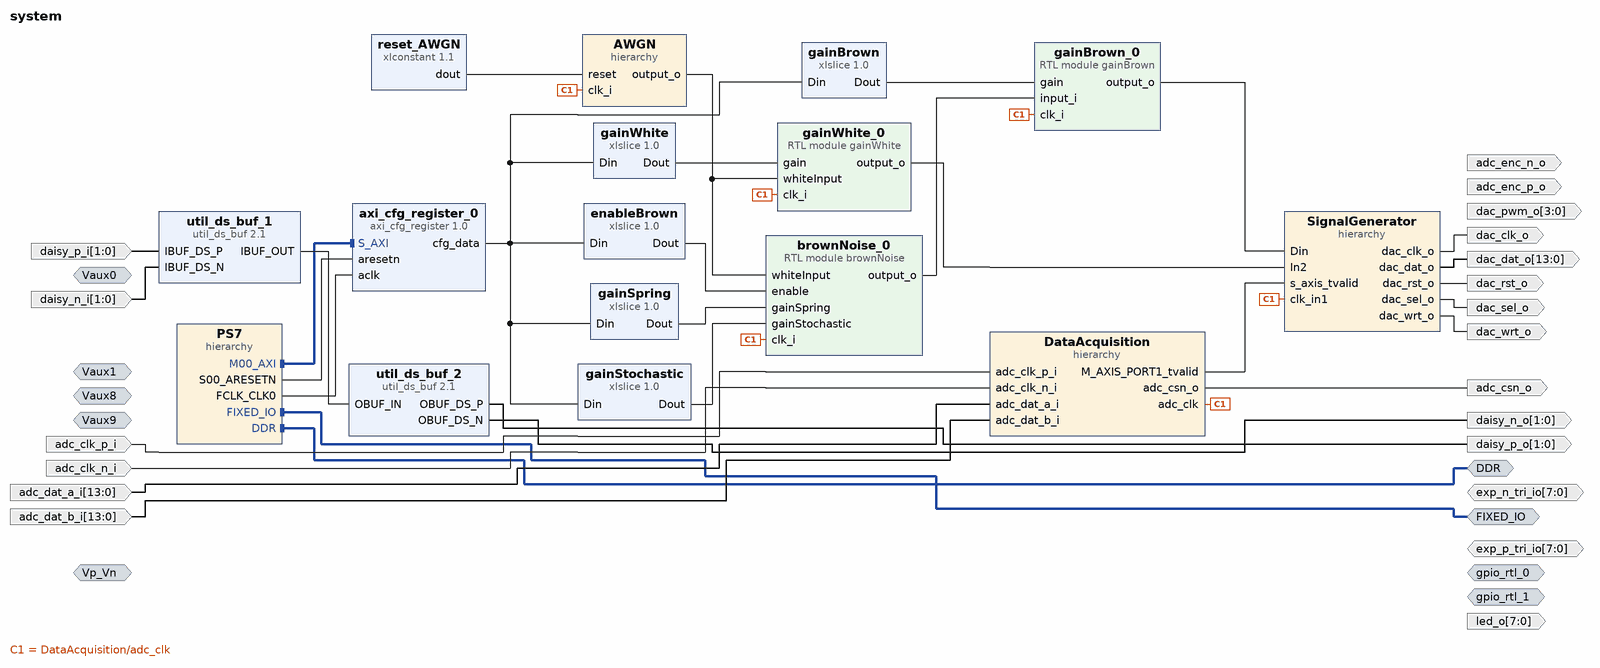
[diagram p0: block diagram of the top level]
# Vivado block design system, xc7z010clg400-1, Vivado 2020.1
create_bd_design system

create_bd_intf_port -mode Slave -vlnv xilinx.com:interface:diff_analog_io_rtl:1.0 Vp_Vn
create_bd_intf_port -mode Slave -vlnv xilinx.com:interface:diff_analog_io_rtl:1.0 Vaux0
create_bd_intf_port -mode Slave -vlnv xilinx.com:interface:diff_analog_io_rtl:1.0 Vaux1
create_bd_intf_port -mode Slave -vlnv xilinx.com:interface:diff_analog_io_rtl:1.0 Vaux9
create_bd_intf_port -mode Slave -vlnv xilinx.com:interface:diff_analog_io_rtl:1.0 Vaux8
create_bd_intf_port -mode Master -vlnv xilinx.com:interface:ddrx_rtl:1.0 DDR
create_bd_intf_port -mode Master -vlnv xilinx.com:display_processing_system7:fixedio_rtl:1.0 FIXED_IO
create_bd_intf_port -mode Master -vlnv xilinx.com:interface:gpio_rtl:1.0 gpio_rtl_0
create_bd_intf_port -mode Master -vlnv xilinx.com:interface:gpio_rtl:1.0 gpio_rtl_1
create_bd_port -dir I -from 13 -to 0 adc_dat_a_i
create_bd_port -dir I -from 13 -to 0 adc_dat_b_i
create_bd_port -dir I adc_clk_p_i
create_bd_port -dir I adc_clk_n_i
create_bd_port -dir O adc_enc_p_o
create_bd_port -dir O adc_enc_n_o
create_bd_port -dir O adc_csn_o
create_bd_port -dir O -from 13 -to 0 dac_dat_o
create_bd_port -dir O dac_clk_o
create_bd_port -dir O dac_rst_o
create_bd_port -dir O dac_sel_o
create_bd_port -dir O dac_wrt_o
create_bd_port -dir O -from 3 -to 0 dac_pwm_o
create_bd_port -dir IO -from 7 -to 0 exp_p_tri_io
create_bd_port -dir IO -from 7 -to 0 exp_n_tri_io
create_bd_port -dir O -from 1 -to 0 daisy_p_o
create_bd_port -dir O -from 1 -to 0 daisy_n_o
create_bd_port -dir I -from 1 -to 0 daisy_p_i
create_bd_port -dir I -from 1 -to 0 daisy_n_i
create_bd_port -dir O -from 7 -to 0 led_o

create_bd_cell -type ip -vlnv xilinx.com:ip:util_ds_buf:2.1 util_ds_buf_1
set_property -dict {CONFIG.C_SIZE 2} [get_bd_cells util_ds_buf_1]
create_bd_cell -type ip -vlnv xilinx.com:ip:util_ds_buf:2.1 util_ds_buf_2
set_property -dict {CONFIG.C_BUF_TYPE OBUFDS CONFIG.C_SIZE 2} [get_bd_cells util_ds_buf_2]
create_bd_cell -type hier SignalGenerator
create_bd_cell -type hier DataAcquisition
create_bd_cell -type hier PS7
create_bd_cell -type ip -vlnv pavel-demin:user:axi_cfg_register:1.0 axi_cfg_register_0
create_bd_cell -type hier AWGN
create_bd_cell -type ip -vlnv xilinx.com:ip:xlconstant:1.1 reset_AWGN
set_property -dict {CONFIG.CONST_VAL 0} [get_bd_cells reset_AWGN]
create_bd_cell -type module -reference brownNoise brownNoise_0
set_property -dict {CONFIG.deltaClk 250} [get_bd_cells brownNoise_0]
create_bd_cell -type module -reference gainBrown gainBrown_0
create_bd_cell -type ip -vlnv xilinx.com:ip:xlslice:1.0 gainSpring
set_property -dict {CONFIG.DIN_FROM 31 CONFIG.DIN_WIDTH 1024 CONFIG.DOUT_WIDTH 32} [get_bd_cells gainSpring]
create_bd_cell -type ip -vlnv xilinx.com:ip:xlslice:1.0 gainBrown
set_property -dict {CONFIG.DIN_FROM 127 CONFIG.DIN_TO 96 CONFIG.DIN_WIDTH 1024 CONFIG.DOUT_WIDTH 32} [get_bd_cells gainBrown]
create_bd_cell -type ip -vlnv xilinx.com:ip:xlslice:1.0 enableBrown
set_property -dict {CONFIG.DIN_FROM 64 CONFIG.DIN_TO 64 CONFIG.DIN_WIDTH 1024 CONFIG.DOUT_WIDTH 1} [get_bd_cells enableBrown]
create_bd_cell -type ip -vlnv xilinx.com:ip:xlslice:1.0 gainStochastic
set_property -dict {CONFIG.DIN_FROM 63 CONFIG.DIN_TO 32 CONFIG.DIN_WIDTH 1024 CONFIG.DOUT_WIDTH 32} [get_bd_cells gainStochastic]
create_bd_cell -type ip -vlnv xilinx.com:ip:xlslice:1.0 gainWhite
set_property -dict {CONFIG.DIN_FROM 159 CONFIG.DIN_TO 128 CONFIG.DIN_WIDTH 1024 CONFIG.DOUT_WIDTH 32} [get_bd_cells gainWhite]
create_bd_cell -type module -reference gainWhite gainWhite_0

# ---- hierarchy /SignalGenerator ----
current_bd_instance /SignalGenerator
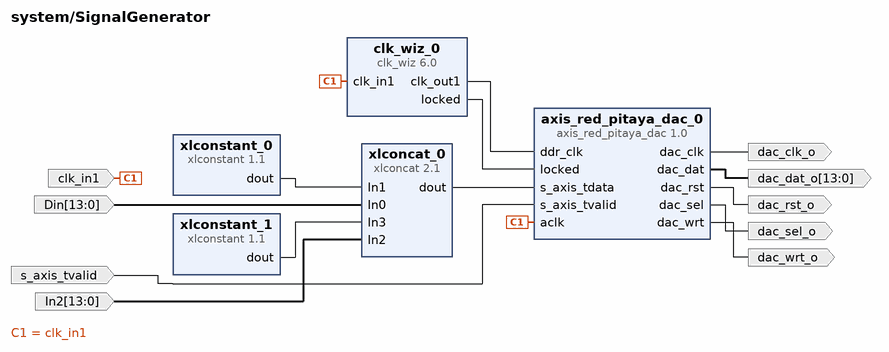
[diagram p1: block diagram inside /SignalGenerator]
create_bd_pin -dir I -type clk clk_in1
create_bd_pin -dir O -type clk dac_clk_o
create_bd_pin -dir O -type rst dac_rst_o
create_bd_pin -dir O dac_sel_o
create_bd_pin -dir O dac_wrt_o
create_bd_pin -dir O -from 13 -to 0 dac_dat_o
create_bd_pin -dir I -from 13 -to 0 Din
create_bd_pin -dir I s_axis_tvalid
create_bd_pin -dir I -from 13 -to 0 In2

create_bd_cell -type ip -vlnv pavel-demin:user:axis_red_pitaya_dac:1.0 axis_red_pitaya_dac_0
create_bd_cell -type ip -vlnv xilinx.com:ip:clk_wiz:6.0 clk_wiz_0
set_property -dict [list \
  CONFIG.CLKIN1_JITTER_PS 80.0 \
  CONFIG.CLKOUT1_JITTER 104.759 \
  CONFIG.CLKOUT1_PHASE_ERROR 96.948 \
  CONFIG.CLKOUT1_REQUESTED_OUT_FREQ 250.000 \
  CONFIG.MMCM_CLKFBOUT_MULT_F 8.000 \
  CONFIG.MMCM_CLKIN1_PERIOD 8.000 \
  CONFIG.MMCM_CLKOUT0_DIVIDE_F 4.000 \
  CONFIG.MMCM_DIVCLK_DIVIDE 1 \
  CONFIG.PRIM_IN_FREQ 125.000 \
  CONFIG.USE_RESET false \
] [get_bd_cells clk_wiz_0]
create_bd_cell -type ip -vlnv xilinx.com:ip:xlconstant:1.1 xlconstant_0
set_property -dict {CONFIG.CONST_VAL 0 CONFIG.CONST_WIDTH 2} [get_bd_cells xlconstant_0]
create_bd_cell -type ip -vlnv xilinx.com:ip:xlconcat:2.1 xlconcat_0
set_property -dict [list \
  CONFIG.IN0_WIDTH 14 \
  CONFIG.IN1_WIDTH 2 \
  CONFIG.IN2_WIDTH 14 \
  CONFIG.IN3_WIDTH 2 \
  CONFIG.NUM_PORTS 4 \
] [get_bd_cells xlconcat_0]
create_bd_cell -type ip -vlnv xilinx.com:ip:xlconstant:1.1 xlconstant_1
set_property -dict {CONFIG.CONST_VAL 0 CONFIG.CONST_WIDTH 2} [get_bd_cells xlconstant_1]

# ---- hierarchy /DataAcquisition ----
current_bd_instance /DataAcquisition
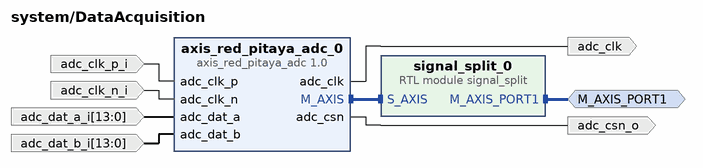
[diagram p2: block diagram inside /DataAcquisition]
create_bd_intf_pin -mode Master -vlnv xilinx.com:interface:axis_rtl:1.0 M_AXIS_PORT1
create_bd_pin -dir O -type clk adc_clk
create_bd_pin -dir O adc_csn_o
create_bd_pin -dir I adc_clk_p_i
create_bd_pin -dir I adc_clk_n_i
create_bd_pin -dir I -from 13 -to 0 adc_dat_a_i
create_bd_pin -dir I -from 13 -to 0 adc_dat_b_i

create_bd_cell -type ip -vlnv pavel-demin:user:axis_red_pitaya_adc:1.0 axis_red_pitaya_adc_0
create_bd_cell -type module -reference signal_split signal_split_0

# ---- hierarchy /PS7 ----
current_bd_instance /PS7
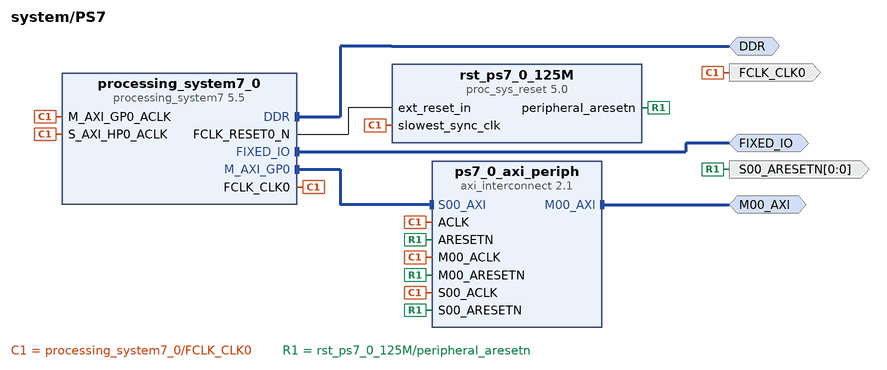
[diagram p3: block diagram inside /PS7]
create_bd_intf_pin -mode Master -vlnv xilinx.com:interface:ddrx_rtl:1.0 DDR
create_bd_intf_pin -mode Master -vlnv xilinx.com:display_processing_system7:fixedio_rtl:1.0 FIXED_IO
create_bd_intf_pin -mode Master -vlnv xilinx.com:interface:aximm_rtl:1.0 M00_AXI
create_bd_pin -dir O -type clk FCLK_CLK0
create_bd_pin -dir O -from 0 -to 0 -type rst S00_ARESETN

create_bd_cell -type ip -vlnv xilinx.com:ip:processing_system7:5.5 processing_system7_0
set_property -dict [list \
  CONFIG.PCW_APU_PERIPHERAL_FREQMHZ 666.666666 \
  CONFIG.PCW_ENET0_ENET0_IO {MIO 16 .. 27} \
  CONFIG.PCW_ENET0_GRP_MDIO_ENABLE 1 \
  CONFIG.PCW_ENET0_GRP_MDIO_IO EMIO \
  CONFIG.PCW_ENET0_PERIPHERAL_ENABLE 1 \
  CONFIG.PCW_ENET0_RESET_ENABLE 0 \
  CONFIG.PCW_ENET_RESET_ENABLE 1 \
  CONFIG.PCW_ENET_RESET_SELECT {Share reset pin} \
  CONFIG.PCW_FPGA0_PERIPHERAL_FREQMHZ 125 \
  CONFIG.PCW_FPGA1_PERIPHERAL_FREQMHZ 250 \
  CONFIG.PCW_FPGA3_PERIPHERAL_FREQMHZ 200 \
  CONFIG.PCW_GPIO_MIO_GPIO_ENABLE 1 \
  CONFIG.PCW_GPIO_MIO_GPIO_IO MIO \
  CONFIG.PCW_GPIO_PERIPHERAL_ENABLE 1 \
  CONFIG.PCW_I2C0_GRP_INT_ENABLE 0 \
  CONFIG.PCW_I2C0_I2C0_IO {MIO 50 .. 51} \
  CONFIG.PCW_I2C0_PERIPHERAL_ENABLE 1 \
  CONFIG.PCW_I2C_PERIPHERAL_FREQMHZ 111.111115 \
  CONFIG.PCW_I2C_RESET_ENABLE 1 \
  CONFIG.PCW_I2C_RESET_SELECT {Share reset pin} \
  CONFIG.PCW_IMPORT_BOARD_PRESET cfg/red_pitaya.xml \
  CONFIG.PCW_PRESET_BANK1_VOLTAGE {LVCMOS 2.5V} \
  CONFIG.PCW_QSPI_GRP_SINGLE_SS_ENABLE 1 \
  CONFIG.PCW_QSPI_GRP_SINGLE_SS_IO {MIO 1 .. 6} \
  CONFIG.PCW_QSPI_PERIPHERAL_ENABLE 1 \
  CONFIG.PCW_QSPI_PERIPHERAL_FREQMHZ 125 \
  CONFIG.PCW_QSPI_QSPI_IO {MIO 1 .. 6} \
  CONFIG.PCW_SD0_GRP_CD_ENABLE 1 \
  CONFIG.PCW_SD0_GRP_CD_IO {MIO 46} \
  CONFIG.PCW_SD0_GRP_WP_ENABLE 1 \
  CONFIG.PCW_SD0_GRP_WP_IO {MIO 47} \
  CONFIG.PCW_SD0_PERIPHERAL_ENABLE 1 \
  CONFIG.PCW_SD0_SD0_IO {MIO 40 .. 45} \
  CONFIG.PCW_SDIO_PERIPHERAL_FREQMHZ 100 \
  CONFIG.PCW_SINGLE_QSPI_DATA_MODE x4 \
  CONFIG.PCW_SPI0_PERIPHERAL_ENABLE 1 \
  CONFIG.PCW_SPI0_SPI0_IO EMIO \
  CONFIG.PCW_SPI1_PERIPHERAL_ENABLE 1 \
  CONFIG.PCW_SPI1_SPI1_IO {MIO 10 .. 15} \
  CONFIG.PCW_TTC0_PERIPHERAL_ENABLE 1 \
  CONFIG.PCW_TTC0_TTC0_IO EMIO \
  CONFIG.PCW_UART0_PERIPHERAL_ENABLE 1 \
  CONFIG.PCW_UART0_UART0_IO {MIO 14 .. 15} \
  CONFIG.PCW_UART1_PERIPHERAL_ENABLE 1 \
  CONFIG.PCW_UART1_UART1_IO {MIO 8 .. 9} \
  CONFIG.PCW_UART_PERIPHERAL_FREQMHZ 100 \
  CONFIG.PCW_UIPARAM_DDR_BUS_WIDTH {16 Bit} \
  CONFIG.PCW_UIPARAM_DDR_FREQ_MHZ 533.333333 \
  CONFIG.PCW_UIPARAM_DDR_PARTNO {MT41J256M16 RE-125} \
  CONFIG.PCW_USB0_PERIPHERAL_ENABLE 1 \
  CONFIG.PCW_USB0_RESET_ENABLE 1 \
  CONFIG.PCW_USB0_RESET_IO {MIO 48} \
  CONFIG.PCW_USB0_USB0_IO {MIO 28 .. 39} \
  CONFIG.PCW_USB_RESET_ENABLE 1 \
  CONFIG.PCW_USB_RESET_SELECT {Share reset pin} \
  CONFIG.PCW_USE_S_AXI_HP0 1 \
] [get_bd_cells processing_system7_0]
# 429 more settings of processing_system7_0 are not shown: defaults, MIO pin electricals, DDR timing, and values the tool derives
create_bd_cell -type ip -vlnv xilinx.com:ip:proc_sys_reset:5.0 rst_ps7_0_125M
create_bd_cell -type ip -vlnv xilinx.com:ip:axi_interconnect:2.1 ps7_0_axi_periph
set_property -dict {CONFIG.NUM_MI 1} [get_bd_cells ps7_0_axi_periph]

# ---- hierarchy /AWGN ----
current_bd_instance /AWGN
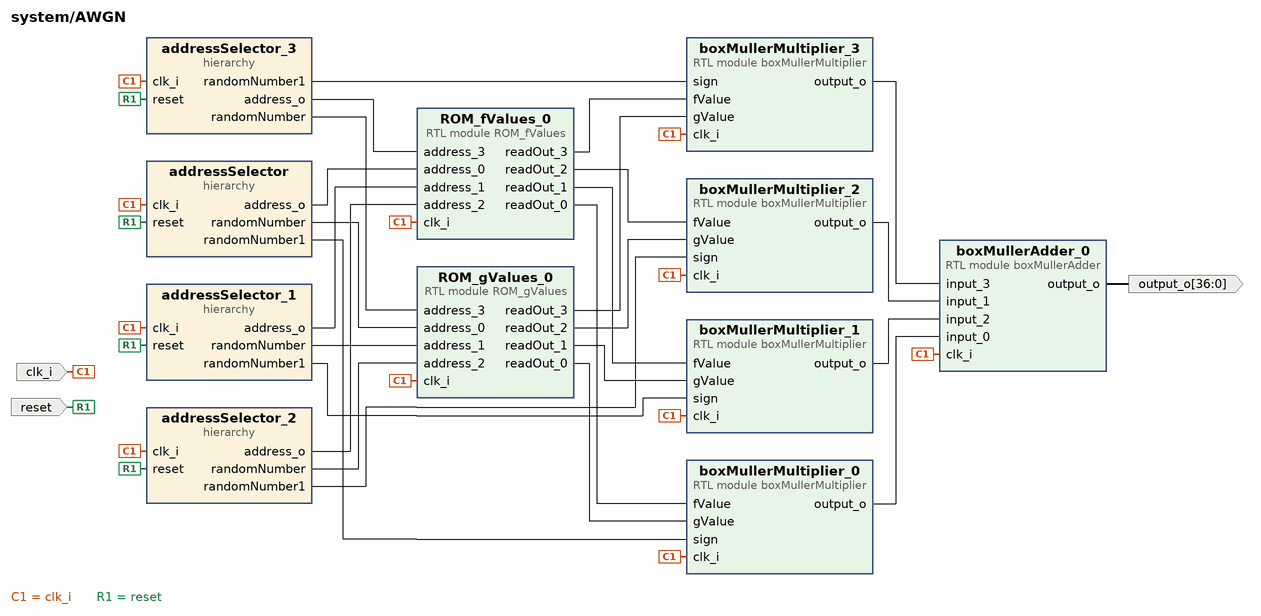
[diagram p4: block diagram inside /AWGN]
create_bd_pin -dir I clk_i
create_bd_pin -dir O -from 36 -to 0 output_o
create_bd_pin -dir I -type rst reset

create_bd_cell -type hier addressSelector
create_bd_cell -type module -reference ROM_gValues ROM_gValues_0
create_bd_cell -type hier addressSelector_1
create_bd_cell -type hier addressSelector_2
create_bd_cell -type hier addressSelector_3
create_bd_cell -type module -reference boxMullerMultiplier boxMullerMultiplier_0
create_bd_cell -type module -reference boxMullerMultiplier boxMullerMultiplier_1
create_bd_cell -type module -reference boxMullerMultiplier boxMullerMultiplier_2
create_bd_cell -type module -reference boxMullerMultiplier boxMullerMultiplier_3
create_bd_cell -type module -reference ROM_fValues ROM_fValues_0
create_bd_cell -type module -reference boxMullerAdder boxMullerAdder_0

# ---- hierarchy /AWGN/addressSelector ----
current_bd_instance /AWGN/addressSelector
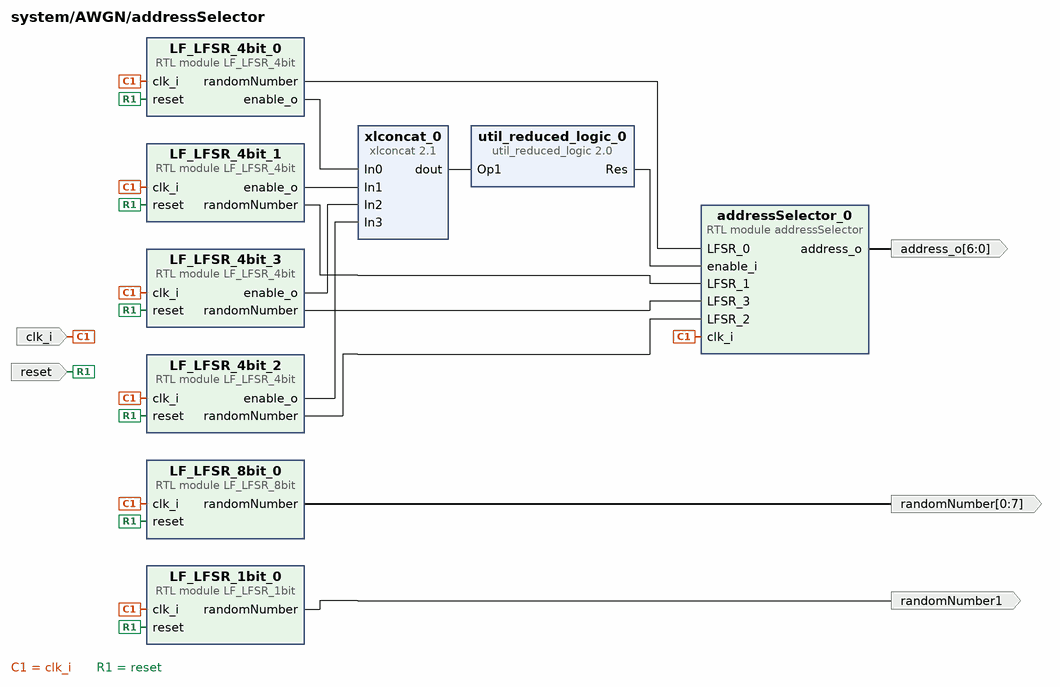
[diagram p5: block diagram inside /AWGN/addressSelector]
create_bd_pin -dir I clk_i
create_bd_pin -dir O -from 6 -to 0 address_o
create_bd_pin -dir O -from 0 -to 7 randomNumber
create_bd_pin -dir O randomNumber1
create_bd_pin -dir I -type rst reset

create_bd_cell -type module -reference LF_LFSR_1bit LF_LFSR_1bit_0
set_property -dict {CONFIG.seed 0b0010010001110011000000111111101010000000010110111010000101010011} [get_bd_cells LF_LFSR_1bit_0]
create_bd_cell -type module -reference LF_LFSR_8bit LF_LFSR_8bit_0
set_property -dict {CONFIG.seed 0b1011000011101000001001000000010001100111010010100010010101100000} [get_bd_cells LF_LFSR_8bit_0]
create_bd_cell -type module -reference LF_LFSR_4bit LF_LFSR_4bit_0
set_property -dict {CONFIG.seed 0b1001000101000000111110010000111010010000111110000001010111000011} [get_bd_cells LF_LFSR_4bit_0]
create_bd_cell -type module -reference LF_LFSR_4bit LF_LFSR_4bit_1
set_property -dict {CONFIG.seed 0b1100100000010011010001111110100011101001111101110001010101010110} [get_bd_cells LF_LFSR_4bit_1]
create_bd_cell -type module -reference LF_LFSR_4bit LF_LFSR_4bit_2
set_property -dict {CONFIG.seed 0b1010000010110111011010100101101111001011010010010101111100011100} [get_bd_cells LF_LFSR_4bit_2]
create_bd_cell -type module -reference LF_LFSR_4bit LF_LFSR_4bit_3
set_property -dict {CONFIG.seed 0b1100110001100010010110011100010111111110111111011000011110011100} [get_bd_cells LF_LFSR_4bit_3]
create_bd_cell -type module -reference addressSelector addressSelector_0
create_bd_cell -type ip -vlnv xilinx.com:ip:util_reduced_logic:2.0 util_reduced_logic_0
set_property -dict {CONFIG.C_SIZE 4} [get_bd_cells util_reduced_logic_0]
create_bd_cell -type ip -vlnv xilinx.com:ip:xlconcat:2.1 xlconcat_0
set_property -dict {CONFIG.NUM_PORTS 4} [get_bd_cells xlconcat_0]

# ---- hierarchy /AWGN/addressSelector_1 ----
current_bd_instance /AWGN/addressSelector_1
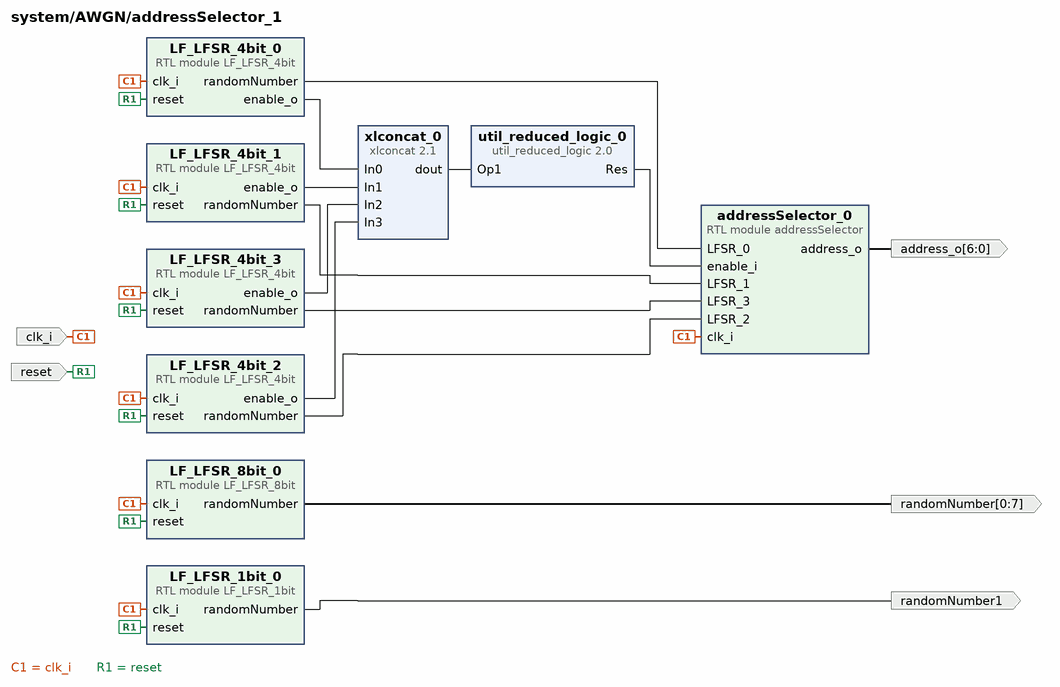
[diagram p6: block diagram inside /AWGN/addressSelector_1]
create_bd_pin -dir I clk_i
create_bd_pin -dir O -from 6 -to 0 address_o
create_bd_pin -dir O -from 0 -to 7 randomNumber
create_bd_pin -dir O randomNumber1
create_bd_pin -dir I -type rst reset

create_bd_cell -type module -reference LF_LFSR_1bit LF_LFSR_1bit_0
set_property -dict {CONFIG.seed 0b0100101001010010101101001010110100101100011100101000100011001100} [get_bd_cells LF_LFSR_1bit_0]
create_bd_cell -type module -reference LF_LFSR_8bit LF_LFSR_8bit_0
set_property -dict {CONFIG.seed 0b0110001010011111001001110100111110000100000011101010110110011101} [get_bd_cells LF_LFSR_8bit_0]
create_bd_cell -type module -reference LF_LFSR_4bit LF_LFSR_4bit_0
set_property -dict {CONFIG.seed 0b1101001111100110110101001001110010111001001111010110010100010101} [get_bd_cells LF_LFSR_4bit_0]
create_bd_cell -type module -reference LF_LFSR_4bit LF_LFSR_4bit_1
set_property -dict {CONFIG.seed 0b1110111110000011011101001111100100110000011111011100110010110101} [get_bd_cells LF_LFSR_4bit_1]
create_bd_cell -type module -reference LF_LFSR_4bit LF_LFSR_4bit_2
set_property -dict {CONFIG.seed 0b1010110100010110011000001010101101000010100011110010111110010101} [get_bd_cells LF_LFSR_4bit_2]
create_bd_cell -type module -reference LF_LFSR_4bit LF_LFSR_4bit_3
set_property -dict {CONFIG.seed 0b1100010010000000111000101001011011001100101100010101000011010011} [get_bd_cells LF_LFSR_4bit_3]
create_bd_cell -type module -reference addressSelector addressSelector_0
create_bd_cell -type ip -vlnv xilinx.com:ip:xlconcat:2.1 xlconcat_0
set_property -dict {CONFIG.NUM_PORTS 4} [get_bd_cells xlconcat_0]
create_bd_cell -type ip -vlnv xilinx.com:ip:util_reduced_logic:2.0 util_reduced_logic_0
set_property -dict {CONFIG.C_SIZE 4} [get_bd_cells util_reduced_logic_0]

# ---- hierarchy /AWGN/addressSelector_2 ----
current_bd_instance /AWGN/addressSelector_2
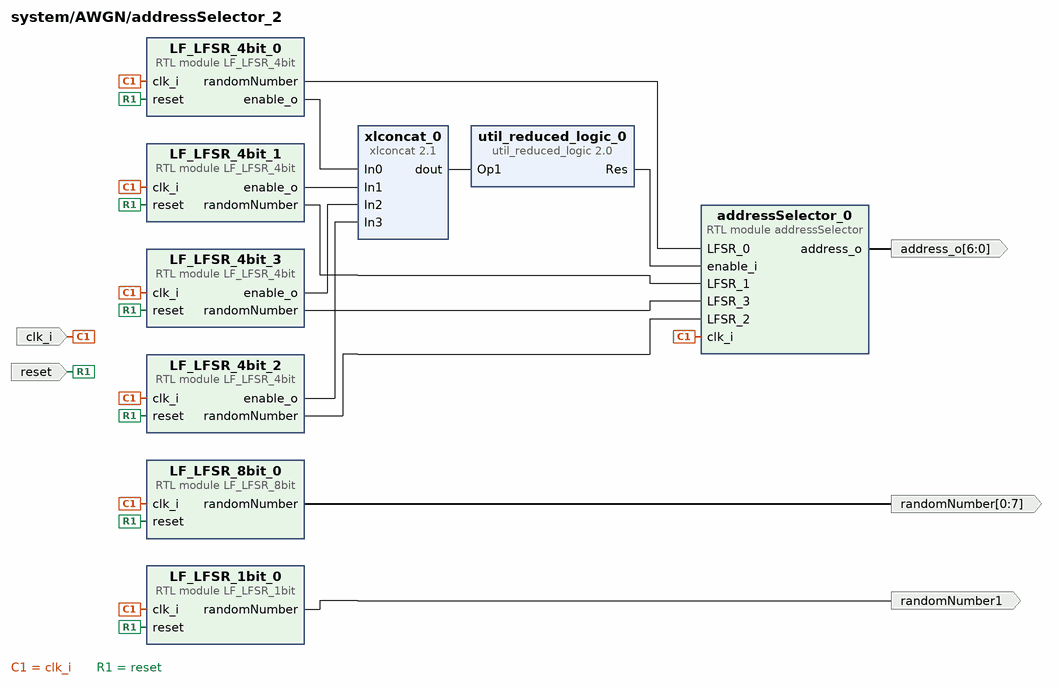
[diagram p7: block diagram inside /AWGN/addressSelector_2]
create_bd_pin -dir I clk_i
create_bd_pin -dir O -from 6 -to 0 address_o
create_bd_pin -dir O -from 0 -to 7 randomNumber
create_bd_pin -dir O randomNumber1
create_bd_pin -dir I -type rst reset

create_bd_cell -type module -reference LF_LFSR_1bit LF_LFSR_1bit_0
set_property -dict {CONFIG.seed 0b0010001001110111011000110111010010101000110100011000110111110000} [get_bd_cells LF_LFSR_1bit_0]
create_bd_cell -type module -reference LF_LFSR_8bit LF_LFSR_8bit_0
set_property -dict {CONFIG.seed 0b0111101010001000101101111101100000000010000101011101010110110101} [get_bd_cells LF_LFSR_8bit_0]
create_bd_cell -type module -reference LF_LFSR_4bit LF_LFSR_4bit_0
set_property -dict {CONFIG.seed 0b1010000001110100000001001111000100010111111111100010010001000111} [get_bd_cells LF_LFSR_4bit_0]
create_bd_cell -type module -reference LF_LFSR_4bit LF_LFSR_4bit_1
set_property -dict {CONFIG.seed 0b1011000110011000100111000000010010011001100000110101010111101111} [get_bd_cells LF_LFSR_4bit_1]
create_bd_cell -type module -reference LF_LFSR_4bit LF_LFSR_4bit_2
set_property -dict {CONFIG.seed 0b0011110110110010101000010101111000001100110110011011101100101010} [get_bd_cells LF_LFSR_4bit_2]
create_bd_cell -type module -reference LF_LFSR_4bit LF_LFSR_4bit_3
set_property -dict {CONFIG.seed 0b0001101010110001100110101110110101100000010100111011100111010110} [get_bd_cells LF_LFSR_4bit_3]
create_bd_cell -type module -reference addressSelector addressSelector_0
create_bd_cell -type ip -vlnv xilinx.com:ip:xlconcat:2.1 xlconcat_0
set_property -dict {CONFIG.NUM_PORTS 4} [get_bd_cells xlconcat_0]
create_bd_cell -type ip -vlnv xilinx.com:ip:util_reduced_logic:2.0 util_reduced_logic_0
set_property -dict {CONFIG.C_SIZE 4} [get_bd_cells util_reduced_logic_0]

# ---- hierarchy /AWGN/addressSelector_3 ----
current_bd_instance /AWGN/addressSelector_3
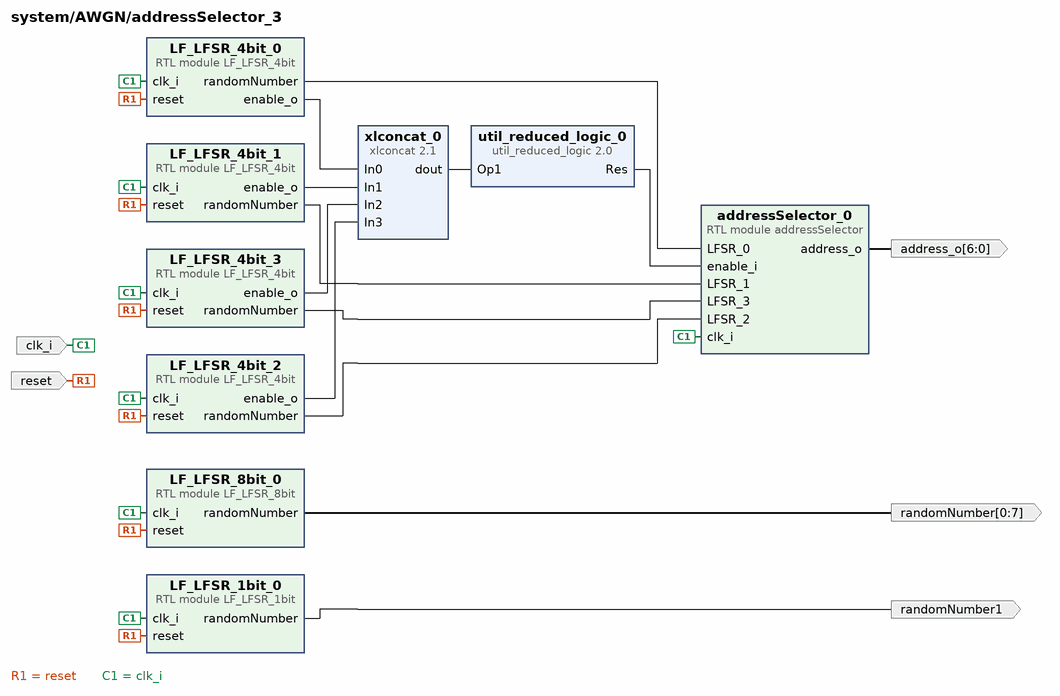
[diagram p8: block diagram inside /AWGN/addressSelector_3]
create_bd_pin -dir I clk_i
create_bd_pin -dir O -from 6 -to 0 address_o
create_bd_pin -dir O -from 0 -to 7 randomNumber
create_bd_pin -dir O randomNumber1
create_bd_pin -dir I -type rst reset

create_bd_cell -type module -reference LF_LFSR_1bit LF_LFSR_1bit_0
set_property -dict {CONFIG.seed 0b0000011000101110001100010110010100100001100011101000011111000111} [get_bd_cells LF_LFSR_1bit_0]
create_bd_cell -type module -reference LF_LFSR_8bit LF_LFSR_8bit_0
set_property -dict {CONFIG.seed 0b1101100100110100111000100101010000111010011010100010111000000010} [get_bd_cells LF_LFSR_8bit_0]
create_bd_cell -type module -reference LF_LFSR_4bit LF_LFSR_4bit_0
set_property -dict {CONFIG.seed 0b1110111110001100101001001011101010101001000001100011110001010000} [get_bd_cells LF_LFSR_4bit_0]
create_bd_cell -type module -reference LF_LFSR_4bit LF_LFSR_4bit_1
set_property -dict {CONFIG.seed 0b0101100100101100001101001010111100111011111010011111110001111010} [get_bd_cells LF_LFSR_4bit_1]
create_bd_cell -type module -reference LF_LFSR_4bit LF_LFSR_4bit_2
set_property -dict {CONFIG.seed 0b1110000010101100010111001100010011100111101010011110110011101010} [get_bd_cells LF_LFSR_4bit_2]
create_bd_cell -type module -reference LF_LFSR_4bit LF_LFSR_4bit_3
set_property -dict {CONFIG.seed 0b0011110011011010101100011110100010101011001101111111000010001100} [get_bd_cells LF_LFSR_4bit_3]
create_bd_cell -type module -reference addressSelector addressSelector_0
create_bd_cell -type ip -vlnv xilinx.com:ip:xlconcat:2.1 xlconcat_0
set_property -dict {CONFIG.NUM_PORTS 4} [get_bd_cells xlconcat_0]
create_bd_cell -type ip -vlnv xilinx.com:ip:util_reduced_logic:2.0 util_reduced_logic_0
set_property -dict {CONFIG.C_SIZE 4} [get_bd_cells util_reduced_logic_0]

# ---- connections ----

current_bd_instance /SignalGenerator
connect_bd_net [get_bd_pins clk_wiz_0/clk_out1] [get_bd_pins axis_red_pitaya_dac_0/ddr_clk]
connect_bd_net [get_bd_pins clk_wiz_0/locked] [get_bd_pins axis_red_pitaya_dac_0/locked]
connect_bd_net -net axis_red_pitaya_adc_0_adc_clk [get_bd_pins clk_in1] [get_bd_pins clk_wiz_0/clk_in1] [get_bd_pins axis_red_pitaya_dac_0/aclk]
connect_bd_net [get_bd_pins axis_red_pitaya_dac_0/dac_clk] [get_bd_pins dac_clk_o]
connect_bd_net [get_bd_pins axis_red_pitaya_dac_0/dac_rst] [get_bd_pins dac_rst_o]
connect_bd_net [get_bd_pins axis_red_pitaya_dac_0/dac_sel] [get_bd_pins dac_sel_o]
connect_bd_net [get_bd_pins axis_red_pitaya_dac_0/dac_wrt] [get_bd_pins dac_wrt_o]
connect_bd_net [get_bd_pins axis_red_pitaya_dac_0/dac_dat] [get_bd_pins dac_dat_o]
connect_bd_net [get_bd_pins Din] [get_bd_pins xlconcat_0/In0]
connect_bd_net [get_bd_pins xlconstant_0/dout] [get_bd_pins xlconcat_0/In1]
connect_bd_net [get_bd_pins xlconcat_0/dout] [get_bd_pins axis_red_pitaya_dac_0/s_axis_tdata]
connect_bd_net [get_bd_pins s_axis_tvalid] [get_bd_pins axis_red_pitaya_dac_0/s_axis_tvalid]
connect_bd_net [get_bd_pins xlconstant_1/dout] [get_bd_pins xlconcat_0/In3]
connect_bd_net -net In2_1 [get_bd_pins In2] [get_bd_pins xlconcat_0/In2]

current_bd_instance /DataAcquisition
connect_bd_intf_net [get_bd_intf_pins signal_split_0/S_AXIS] [get_bd_intf_pins axis_red_pitaya_adc_0/M_AXIS]
connect_bd_intf_net [get_bd_intf_pins M_AXIS_PORT1] [get_bd_intf_pins signal_split_0/M_AXIS_PORT1]
connect_bd_net [get_bd_pins axis_red_pitaya_adc_0/adc_clk] [get_bd_pins adc_clk]
connect_bd_net [get_bd_pins axis_red_pitaya_adc_0/adc_csn] [get_bd_pins adc_csn_o]
connect_bd_net [get_bd_pins adc_clk_p_i] [get_bd_pins axis_red_pitaya_adc_0/adc_clk_p]
connect_bd_net [get_bd_pins adc_clk_n_i] [get_bd_pins axis_red_pitaya_adc_0/adc_clk_n]
connect_bd_net [get_bd_pins adc_dat_a_i] [get_bd_pins axis_red_pitaya_adc_0/adc_dat_a]
connect_bd_net [get_bd_pins adc_dat_b_i] [get_bd_pins axis_red_pitaya_adc_0/adc_dat_b]

current_bd_instance /PS7
connect_bd_intf_net [get_bd_intf_pins M00_AXI] [get_bd_intf_pins ps7_0_axi_periph/M00_AXI]
connect_bd_intf_net [get_bd_intf_pins DDR] [get_bd_intf_pins processing_system7_0/DDR]
connect_bd_intf_net [get_bd_intf_pins processing_system7_0/M_AXI_GP0] [get_bd_intf_pins ps7_0_axi_periph/S00_AXI]
connect_bd_intf_net [get_bd_intf_pins FIXED_IO] [get_bd_intf_pins processing_system7_0/FIXED_IO]
connect_bd_net [get_bd_pins processing_system7_0/FCLK_RESET0_N] [get_bd_pins rst_ps7_0_125M/ext_reset_in]
connect_bd_net [get_bd_pins processing_system7_0/FCLK_CLK0] \
  [get_bd_pins FCLK_CLK0] [get_bd_pins processing_system7_0/S_AXI_HP0_ACLK] [get_bd_pins ps7_0_axi_periph/S00_ACLK] \
  [get_bd_pins rst_ps7_0_125M/slowest_sync_clk] [get_bd_pins ps7_0_axi_periph/M00_ACLK] [get_bd_pins ps7_0_axi_periph/ACLK] \
  [get_bd_pins processing_system7_0/M_AXI_GP0_ACLK]
connect_bd_net [get_bd_pins rst_ps7_0_125M/peripheral_aresetn] \
  [get_bd_pins S00_ARESETN] [get_bd_pins ps7_0_axi_periph/S00_ARESETN] [get_bd_pins ps7_0_axi_periph/M00_ARESETN] \
  [get_bd_pins ps7_0_axi_periph/ARESETN]

current_bd_instance /AWGN
connect_bd_net [get_bd_pins clk_i] \
  [get_bd_pins addressSelector/clk_i] [get_bd_pins ROM_gValues_0/clk_i] [get_bd_pins addressSelector_1/clk_i] \
  [get_bd_pins addressSelector_2/clk_i] [get_bd_pins addressSelector_3/clk_i] [get_bd_pins boxMullerMultiplier_0/clk_i] \
  [get_bd_pins boxMullerMultiplier_1/clk_i] [get_bd_pins boxMullerMultiplier_2/clk_i] \
  [get_bd_pins boxMullerMultiplier_3/clk_i] [get_bd_pins ROM_fValues_0/clk_i] [get_bd_pins boxMullerAdder_0/clk_i]
connect_bd_net [get_bd_pins addressSelector/address_o] [get_bd_pins ROM_fValues_0/address_0]
connect_bd_net [get_bd_pins addressSelector/randomNumber] [get_bd_pins ROM_gValues_0/address_0]
connect_bd_net [get_bd_pins ROM_fValues_0/readOut_0] [get_bd_pins boxMullerMultiplier_0/fValue]
connect_bd_net [get_bd_pins ROM_gValues_0/readOut_0] [get_bd_pins boxMullerMultiplier_0/gValue]
connect_bd_net [get_bd_pins addressSelector/randomNumber1] [get_bd_pins boxMullerMultiplier_0/sign]
connect_bd_net [get_bd_pins addressSelector_1/address_o] [get_bd_pins ROM_fValues_0/address_1]
connect_bd_net [get_bd_pins addressSelector_1/randomNumber] [get_bd_pins ROM_gValues_0/address_1]
connect_bd_net [get_bd_pins addressSelector_1/randomNumber1] [get_bd_pins boxMullerMultiplier_1/sign]
connect_bd_net [get_bd_pins ROM_fValues_0/readOut_1] [get_bd_pins boxMullerMultiplier_1/fValue]
connect_bd_net [get_bd_pins ROM_gValues_0/readOut_1] [get_bd_pins boxMullerMultiplier_1/gValue]
connect_bd_net [get_bd_pins addressSelector_2/address_o] [get_bd_pins ROM_fValues_0/address_2]
connect_bd_net [get_bd_pins addressSelector_2/randomNumber] [get_bd_pins ROM_gValues_0/address_2]
connect_bd_net [get_bd_pins addressSelector_2/randomNumber1] [get_bd_pins boxMullerMultiplier_2/sign]
connect_bd_net [get_bd_pins ROM_gValues_0/readOut_2] [get_bd_pins boxMullerMultiplier_2/gValue]
connect_bd_net [get_bd_pins ROM_fValues_0/readOut_2] [get_bd_pins boxMullerMultiplier_2/fValue]
connect_bd_net [get_bd_pins addressSelector_3/address_o] [get_bd_pins ROM_fValues_0/address_3]
connect_bd_net [get_bd_pins addressSelector_3/randomNumber] [get_bd_pins ROM_gValues_0/address_3]
connect_bd_net [get_bd_pins addressSelector_3/randomNumber1] [get_bd_pins boxMullerMultiplier_3/sign]
connect_bd_net [get_bd_pins ROM_fValues_0/readOut_3] [get_bd_pins boxMullerMultiplier_3/fValue]
connect_bd_net [get_bd_pins ROM_gValues_0/readOut_3] [get_bd_pins boxMullerMultiplier_3/gValue]
connect_bd_net [get_bd_pins boxMullerMultiplier_0/output_o] [get_bd_pins boxMullerAdder_0/input_0]
connect_bd_net [get_bd_pins boxMullerMultiplier_2/output_o] [get_bd_pins boxMullerAdder_0/input_1]
connect_bd_net [get_bd_pins boxMullerMultiplier_1/output_o] [get_bd_pins boxMullerAdder_0/input_2]
connect_bd_net [get_bd_pins boxMullerMultiplier_3/output_o] [get_bd_pins boxMullerAdder_0/input_3]
connect_bd_net -net xlconstant_1_dout [get_bd_pins reset] \
  [get_bd_pins addressSelector/reset] [get_bd_pins addressSelector_3/reset] [get_bd_pins addressSelector_2/reset] \
  [get_bd_pins addressSelector_1/reset]
connect_bd_net [get_bd_pins boxMullerAdder_0/output_o] [get_bd_pins output_o]

current_bd_instance /AWGN/addressSelector
connect_bd_net [get_bd_pins clk_i] \
  [get_bd_pins LF_LFSR_8bit_0/clk_i] [get_bd_pins LF_LFSR_1bit_0/clk_i] [get_bd_pins LF_LFSR_4bit_0/clk_i] \
  [get_bd_pins LF_LFSR_4bit_1/clk_i] [get_bd_pins LF_LFSR_4bit_2/clk_i] [get_bd_pins LF_LFSR_4bit_3/clk_i] \
  [get_bd_pins addressSelector_0/clk_i]
connect_bd_net [get_bd_pins LF_LFSR_4bit_0/randomNumber] [get_bd_pins addressSelector_0/LFSR_0]
connect_bd_net [get_bd_pins LF_LFSR_4bit_1/randomNumber] [get_bd_pins addressSelector_0/LFSR_1]
connect_bd_net [get_bd_pins LF_LFSR_4bit_2/randomNumber] [get_bd_pins addressSelector_0/LFSR_2]
connect_bd_net [get_bd_pins LF_LFSR_4bit_3/randomNumber] [get_bd_pins addressSelector_0/LFSR_3]
connect_bd_net [get_bd_pins addressSelector_0/address_o] [get_bd_pins address_o]
connect_bd_net [get_bd_pins LF_LFSR_8bit_0/randomNumber] [get_bd_pins randomNumber]
connect_bd_net [get_bd_pins LF_LFSR_1bit_0/randomNumber] [get_bd_pins randomNumber1]
connect_bd_net [get_bd_pins reset] \
  [get_bd_pins LF_LFSR_8bit_0/reset] [get_bd_pins LF_LFSR_1bit_0/reset] [get_bd_pins LF_LFSR_4bit_0/reset] \
  [get_bd_pins LF_LFSR_4bit_1/reset] [get_bd_pins LF_LFSR_4bit_2/reset] [get_bd_pins LF_LFSR_4bit_3/reset]
connect_bd_net [get_bd_pins LF_LFSR_4bit_0/enable_o] [get_bd_pins xlconcat_0/In0]
connect_bd_net [get_bd_pins LF_LFSR_4bit_1/enable_o] [get_bd_pins xlconcat_0/In1]
connect_bd_net [get_bd_pins LF_LFSR_4bit_3/enable_o] [get_bd_pins xlconcat_0/In2]
connect_bd_net [get_bd_pins LF_LFSR_4bit_2/enable_o] [get_bd_pins xlconcat_0/In3]
connect_bd_net [get_bd_pins xlconcat_0/dout] [get_bd_pins util_reduced_logic_0/Op1]
connect_bd_net [get_bd_pins util_reduced_logic_0/Res] [get_bd_pins addressSelector_0/enable_i]

current_bd_instance /AWGN/addressSelector_1
connect_bd_net [get_bd_pins clk_i] \
  [get_bd_pins LF_LFSR_8bit_0/clk_i] [get_bd_pins LF_LFSR_1bit_0/clk_i] [get_bd_pins LF_LFSR_4bit_0/clk_i] \
  [get_bd_pins LF_LFSR_4bit_1/clk_i] [get_bd_pins LF_LFSR_4bit_2/clk_i] [get_bd_pins LF_LFSR_4bit_3/clk_i] \
  [get_bd_pins addressSelector_0/clk_i]
connect_bd_net [get_bd_pins LF_LFSR_4bit_0/randomNumber] [get_bd_pins addressSelector_0/LFSR_0]
connect_bd_net [get_bd_pins LF_LFSR_4bit_1/randomNumber] [get_bd_pins addressSelector_0/LFSR_1]
connect_bd_net [get_bd_pins LF_LFSR_4bit_2/randomNumber] [get_bd_pins addressSelector_0/LFSR_2]
connect_bd_net [get_bd_pins LF_LFSR_4bit_3/randomNumber] [get_bd_pins addressSelector_0/LFSR_3]
connect_bd_net [get_bd_pins addressSelector_0/address_o] [get_bd_pins address_o]
connect_bd_net [get_bd_pins LF_LFSR_8bit_0/randomNumber] [get_bd_pins randomNumber]
connect_bd_net [get_bd_pins LF_LFSR_1bit_0/randomNumber] [get_bd_pins randomNumber1]
connect_bd_net [get_bd_pins reset] \
  [get_bd_pins LF_LFSR_8bit_0/reset] [get_bd_pins LF_LFSR_1bit_0/reset] [get_bd_pins LF_LFSR_4bit_0/reset] \
  [get_bd_pins LF_LFSR_4bit_1/reset] [get_bd_pins LF_LFSR_4bit_2/reset] [get_bd_pins LF_LFSR_4bit_3/reset]
connect_bd_net [get_bd_pins LF_LFSR_4bit_0/enable_o] [get_bd_pins xlconcat_0/In0]
connect_bd_net [get_bd_pins LF_LFSR_4bit_1/enable_o] [get_bd_pins xlconcat_0/In1]
connect_bd_net [get_bd_pins LF_LFSR_4bit_3/enable_o] [get_bd_pins xlconcat_0/In2]
connect_bd_net [get_bd_pins LF_LFSR_4bit_2/enable_o] [get_bd_pins xlconcat_0/In3]
connect_bd_net [get_bd_pins xlconcat_0/dout] [get_bd_pins util_reduced_logic_0/Op1]
connect_bd_net [get_bd_pins util_reduced_logic_0/Res] [get_bd_pins addressSelector_0/enable_i]

current_bd_instance /AWGN/addressSelector_2
connect_bd_net [get_bd_pins clk_i] \
  [get_bd_pins LF_LFSR_8bit_0/clk_i] [get_bd_pins LF_LFSR_1bit_0/clk_i] [get_bd_pins LF_LFSR_4bit_0/clk_i] \
  [get_bd_pins LF_LFSR_4bit_1/clk_i] [get_bd_pins LF_LFSR_4bit_2/clk_i] [get_bd_pins LF_LFSR_4bit_3/clk_i] \
  [get_bd_pins addressSelector_0/clk_i]
connect_bd_net [get_bd_pins LF_LFSR_4bit_0/randomNumber] [get_bd_pins addressSelector_0/LFSR_0]
connect_bd_net [get_bd_pins LF_LFSR_4bit_1/randomNumber] [get_bd_pins addressSelector_0/LFSR_1]
connect_bd_net [get_bd_pins LF_LFSR_4bit_2/randomNumber] [get_bd_pins addressSelector_0/LFSR_2]
connect_bd_net [get_bd_pins LF_LFSR_4bit_3/randomNumber] [get_bd_pins addressSelector_0/LFSR_3]
connect_bd_net [get_bd_pins addressSelector_0/address_o] [get_bd_pins address_o]
connect_bd_net [get_bd_pins LF_LFSR_8bit_0/randomNumber] [get_bd_pins randomNumber]
connect_bd_net [get_bd_pins LF_LFSR_1bit_0/randomNumber] [get_bd_pins randomNumber1]
connect_bd_net [get_bd_pins reset] \
  [get_bd_pins LF_LFSR_8bit_0/reset] [get_bd_pins LF_LFSR_1bit_0/reset] [get_bd_pins LF_LFSR_4bit_0/reset] \
  [get_bd_pins LF_LFSR_4bit_1/reset] [get_bd_pins LF_LFSR_4bit_2/reset] [get_bd_pins LF_LFSR_4bit_3/reset]
connect_bd_net [get_bd_pins LF_LFSR_4bit_0/enable_o] [get_bd_pins xlconcat_0/In0]
connect_bd_net [get_bd_pins LF_LFSR_4bit_1/enable_o] [get_bd_pins xlconcat_0/In1]
connect_bd_net [get_bd_pins LF_LFSR_4bit_3/enable_o] [get_bd_pins xlconcat_0/In2]
connect_bd_net [get_bd_pins LF_LFSR_4bit_2/enable_o] [get_bd_pins xlconcat_0/In3]
connect_bd_net [get_bd_pins xlconcat_0/dout] [get_bd_pins util_reduced_logic_0/Op1]
connect_bd_net [get_bd_pins util_reduced_logic_0/Res] [get_bd_pins addressSelector_0/enable_i]

current_bd_instance /AWGN/addressSelector_3
connect_bd_net [get_bd_pins LF_LFSR_4bit_0/randomNumber] [get_bd_pins addressSelector_0/LFSR_0]
connect_bd_net [get_bd_pins LF_LFSR_4bit_1/randomNumber] [get_bd_pins addressSelector_0/LFSR_1]
connect_bd_net [get_bd_pins LF_LFSR_4bit_2/randomNumber] [get_bd_pins addressSelector_0/LFSR_2]
connect_bd_net [get_bd_pins LF_LFSR_4bit_3/randomNumber] [get_bd_pins addressSelector_0/LFSR_3]
connect_bd_net [get_bd_pins addressSelector_0/address_o] [get_bd_pins address_o]
connect_bd_net [get_bd_pins LF_LFSR_8bit_0/randomNumber] [get_bd_pins randomNumber]
connect_bd_net [get_bd_pins LF_LFSR_1bit_0/randomNumber] [get_bd_pins randomNumber1]
connect_bd_net [get_bd_pins reset] \
  [get_bd_pins LF_LFSR_8bit_0/reset] [get_bd_pins LF_LFSR_1bit_0/reset] [get_bd_pins LF_LFSR_4bit_0/reset] \
  [get_bd_pins LF_LFSR_4bit_1/reset] [get_bd_pins LF_LFSR_4bit_2/reset] [get_bd_pins LF_LFSR_4bit_3/reset]
connect_bd_net [get_bd_pins clk_i] \
  [get_bd_pins LF_LFSR_8bit_0/clk_i] [get_bd_pins LF_LFSR_1bit_0/clk_i] [get_bd_pins LF_LFSR_4bit_0/clk_i] \
  [get_bd_pins LF_LFSR_4bit_1/clk_i] [get_bd_pins LF_LFSR_4bit_2/clk_i] [get_bd_pins LF_LFSR_4bit_3/clk_i] \
  [get_bd_pins addressSelector_0/clk_i]
connect_bd_net [get_bd_pins LF_LFSR_4bit_0/enable_o] [get_bd_pins xlconcat_0/In0]
connect_bd_net [get_bd_pins LF_LFSR_4bit_1/enable_o] [get_bd_pins xlconcat_0/In1]
connect_bd_net [get_bd_pins LF_LFSR_4bit_3/enable_o] [get_bd_pins xlconcat_0/In2]
connect_bd_net [get_bd_pins LF_LFSR_4bit_2/enable_o] [get_bd_pins xlconcat_0/In3]
connect_bd_net [get_bd_pins xlconcat_0/dout] [get_bd_pins util_reduced_logic_0/Op1]
connect_bd_net [get_bd_pins util_reduced_logic_0/Res] [get_bd_pins addressSelector_0/enable_i]

current_bd_instance /
connect_bd_intf_net [get_bd_intf_pins PS7/M00_AXI] [get_bd_intf_pins axi_cfg_register_0/S_AXI]
connect_bd_intf_net -intf_net processing_system7_0_FIXED_IO [get_bd_intf_ports FIXED_IO] [get_bd_intf_pins PS7/FIXED_IO]
connect_bd_intf_net -intf_net processing_system7_0_DDR [get_bd_intf_ports DDR] [get_bd_intf_pins PS7/DDR]
connect_bd_net [get_bd_ports daisy_p_i] [get_bd_pins util_ds_buf_1/IBUF_DS_P]
connect_bd_net [get_bd_ports daisy_n_i] [get_bd_pins util_ds_buf_1/IBUF_DS_N]
connect_bd_net [get_bd_pins util_ds_buf_2/OBUF_DS_P] [get_bd_ports daisy_p_o]
connect_bd_net [get_bd_pins util_ds_buf_2/OBUF_DS_N] [get_bd_ports daisy_n_o]
connect_bd_net [get_bd_pins util_ds_buf_1/IBUF_OUT] [get_bd_pins util_ds_buf_2/OBUF_IN]
connect_bd_net [get_bd_ports adc_clk_p_i] [get_bd_pins DataAcquisition/adc_clk_p_i]
connect_bd_net [get_bd_ports adc_clk_n_i] [get_bd_pins DataAcquisition/adc_clk_n_i]
connect_bd_net [get_bd_ports adc_dat_a_i] [get_bd_pins DataAcquisition/adc_dat_a_i]
connect_bd_net [get_bd_ports adc_dat_b_i] [get_bd_pins DataAcquisition/adc_dat_b_i]
connect_bd_net -net axis_red_pitaya_adc_0_adc_csn [get_bd_pins DataAcquisition/adc_csn_o] [get_bd_ports adc_csn_o]
connect_bd_net -net axis_red_pitaya_dac_0_dac_clk [get_bd_pins SignalGenerator/dac_clk_o] [get_bd_ports dac_clk_o]
connect_bd_net -net axis_red_pitaya_dac_0_dac_rst [get_bd_pins SignalGenerator/dac_rst_o] [get_bd_ports dac_rst_o]
connect_bd_net -net axis_red_pitaya_dac_0_dac_sel [get_bd_pins SignalGenerator/dac_sel_o] [get_bd_ports dac_sel_o]
connect_bd_net -net axis_red_pitaya_dac_0_dac_wrt [get_bd_pins SignalGenerator/dac_wrt_o] [get_bd_ports dac_wrt_o]
connect_bd_net -net axis_red_pitaya_dac_0_dac_dat [get_bd_pins SignalGenerator/dac_dat_o] [get_bd_ports dac_dat_o]
connect_bd_net [get_bd_pins DataAcquisition/M_AXIS_PORT1_tvalid] [get_bd_pins SignalGenerator/s_axis_tvalid]
connect_bd_net [get_bd_pins PS7/S00_ARESETN] [get_bd_pins axi_cfg_register_0/aresetn]
connect_bd_net [get_bd_pins PS7/FCLK_CLK0] [get_bd_pins axi_cfg_register_0/aclk]
connect_bd_net -net axis_red_pitaya_adc_0_adc_clk [get_bd_pins DataAcquisition/adc_clk] \
  [get_bd_pins SignalGenerator/clk_in1] [get_bd_pins AWGN/clk_i] [get_bd_pins brownNoise_0/clk_i] \
  [get_bd_pins gainBrown_0/clk_i] [get_bd_pins gainWhite_0/clk_i]
connect_bd_net -net xlconstant_0_dout [get_bd_pins reset_AWGN/dout] [get_bd_pins AWGN/reset]
connect_bd_net [get_bd_pins AWGN/output_o] [get_bd_pins brownNoise_0/whiteInput] [get_bd_pins gainWhite_0/whiteInput]
connect_bd_net [get_bd_pins brownNoise_0/output_o] [get_bd_pins gainBrown_0/input_i]
connect_bd_net [get_bd_pins gainBrown_0/output_o] [get_bd_pins SignalGenerator/Din]
connect_bd_net [get_bd_pins axi_cfg_register_0/cfg_data] \
  [get_bd_pins gainSpring/Din] [get_bd_pins gainStochastic/Din] [get_bd_pins enableBrown/Din] [get_bd_pins gainBrown/Din] \
  [get_bd_pins gainWhite/Din]
connect_bd_net [get_bd_pins gainSpring/Dout] [get_bd_pins brownNoise_0/gainSpring]
connect_bd_net [get_bd_pins gainStochastic/Dout] [get_bd_pins brownNoise_0/gainStochastic]
connect_bd_net [get_bd_pins enableBrown/Dout] [get_bd_pins brownNoise_0/enable]
connect_bd_net [get_bd_pins gainBrown/Dout] [get_bd_pins gainBrown_0/gain]
connect_bd_net [get_bd_pins gainWhite/Dout] [get_bd_pins gainWhite_0/gain]
connect_bd_net [get_bd_pins gainWhite_0/output_o] [get_bd_pins SignalGenerator/In2]

# ---- address map ----
assign_bd_address -offset 0x40000000 -range 2K -target_address_space [get_bd_addr_spaces PS7/processing_system7_0/Data] [get_bd_addr_segs axi_cfg_register_0/s_axi/reg0]

validate_bd_design
save_bd_design
